# EAGLE schematic Brainstorm (EAGLE 9.0.1)
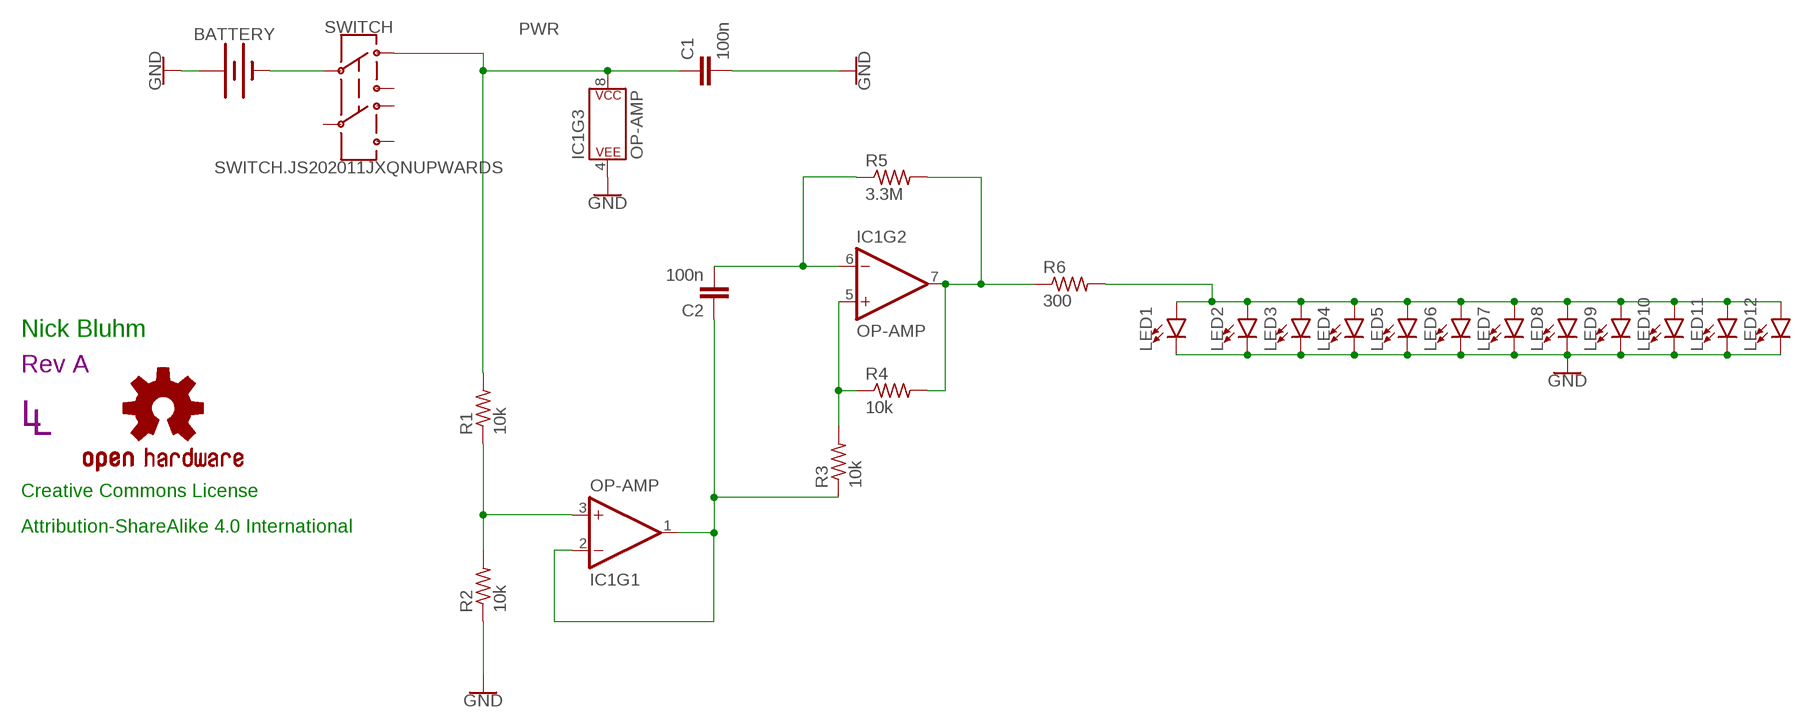
[diagram p0: schematic, sheet 1]

## Parts
BATTERY  BATTERY-20MM_SMD  [BATTCON_20MM]
C1  100n  CAPACITOR0402  [C0402]
C2  100n  CAPACITOR0402  [C0402]
IC1  OP-AMP  OPAMP-DUALU  [SO08]
LED1  LED5MM  [LED_5MM]
LED2  LED5MM  [LED_5MM]
LED3  LED5MM  [LED_5MM]
LED4  LED5MM  [LED_5MM]
LED5  LED5MM  [LED_5MM]
LED6  LED5MM  [LED_5MM]
LED7  LED5MM  [LED_5MM]
LED8  LED5MM  [LED_5MM]
LED9  LED5MM  [LED_5MM]
LED10  LED5MM  [LED_5MM]
LED11  LED5MM  [LED_5MM]
LED12  LED5MM  [LED_5MM]
LOGO1  OSHW-LOGOL-COPPER  [OSHW-LOGO-L_COPPER]
R1  10k  RESISTOR0603  [R0603]
R2  10k  RESISTOR0603  [R0603]
R3  10k  RESISTOR0603  [R0603]
R4  10k  RESISTOR0603  [R0603]
R5  3.3M  RESISTOR0603  [R0603]
R6  300  RESISTOR0603  [R0603]
SWITCH  SWITCH.JS202011JXQNUPWARDS  [SWITCH.00]
U$4  REVISION.A  [REV.A]
U$5  LINNES.LAB.LOGO  [LINNES.LAB.LOGO]

## Nets
GND: BATTERY.1(+) C1.2 IC1.4(P$V-) LED1.K(C) LED2.K(C) LED3.K(C) LED4.K(C) LED5.K(C) LED6.K(C) LED7.K(C) LED8.K(C) LED9.K(C) LED10.K(C) LED11.K(C) LED12.K(C) R2.1
N$2: IC1.3(+IN) R1.1 R2.2
N$3: LED1.A LED2.A LED3.A LED4.A LED5.A LED6.A LED7.A LED8.A LED9.A LED10.A LED11.A LED12.A R6.2
N$4: C2.1 IC1.1(OUT) IC1.2(-IN) R3.1
N$5: C2.2 IC1.6(-IN) R5.1
N$6: IC1.5(+IN) R3.2 R4.1
N$7: IC1.7(OUT) R4.2 R5.2 R6.1
N$9: BATTERY.2(-) SWITCH.2
PWR: C1.1 IC1.8(P$V+) R1.2 SWITCH.1
Unconnected: SWITCH.3 SWITCH.5 SWITCH.6 SWITCH.7

## Notes on the sheet
- Nick Bluhm
- Creative Commons License
- Attribution-ShareAlike 4.0 International

## Library data of the parts
BATTERY = SparkFun-Batteries:BATTERY: Battery - Single Cell A variety of battery chemistries, sizes, and footprints. Device List: 20MM_PTH - Coin Cell Battery Holder - 20mm (PTH) <https://www.sparkfun.com/products/783> 6.8MM_PTH - Coin Cell Battery Holder - 6.8MM(SMD) <https://www.digikey.com/product-detail/en/seiko-instruments/MS621FE-FL11E/728-1057-ND/1889208?WT.srch=1&gclid=CNOQ5a6LzdQCFZS2wAodXCkE0g> 12MM_SMD - Coin Cell Battery Holder - 12mm (SMD) <https://www.sparkfun.com/products/10592> 12MM_PTH - Coin Cell Battery Holder - 12mm (PTH) <https://www.sparkfun.com/products/7948> 20MM_SMD - 20mm Coin Cell Battery Holder (SMD) (2 legs) Used on the Big Time Watch Kit <https://www.sparkfun.com/products/11734> 20MM_SMD_4LEGS - Coin Cell Battery Holder - 20mm (SMD) <https://www.sparkfun.com/products/11892> 20MM_SMD_4LEGS_OVERPASTE - Coin Cell Battery Holder - 20mm (SMD) <https://www.sparkfun.com/products/11892> (Over-paste on the legs) 24.5MM_PTH - Coin Cell Battery Holder - 24.5mm (PTH) <https://www.sparkfun.com/products/8863> 9V - 9V Battery Holder - PC Mount Used on the SparkFun SparkPunk Sound Kit <https://www.sparkfun.com/products/11177> and SparkFun SparkPunk Sequencer Kit <https://www.sparkfun.com/products/12707> 18650 - Battery Holder - 18650 (PTH) <https://www.sparkfun.com/products/13113> AA - Battery Holder - 1xAA (PTH) <https://www.sparkfun.com/products/7949> AAA - Battery Holder - 1xAAA (PTH) <https://www.sparkfun.com/products/12718> AA_KIT - Battery Holder - 1xAA (PTH) <https://www.sparkfun.com/products/7949> Special kit package - pads only have exposed copper on one side of the board. AAA_KIT - Battery Holder - 1xAAA (PTH) <https://www.sparkfun.com/products/12718> Special kit package - pads only have exposed copper on one side of the board.; PROD_ID: BATT-11519
C1 C2 = CalvEngIO-Passives:CAPACITOR
IC1 = SparkFun-IC-Amplifiers:OPAMP-DUAL: Generic op-amp footprint This component is for the standard 358 pinning of a dual op-amp From the LM358 datasheet: Pin 1: Output A Pin 2: Inverting Input A Pin 3: Non-Inverting Input A Pin 4: Gnd Pin 5: Non-Inverting Input B Pin 6: Inverting Input B Pin 7: Output B Pin 8: V+; PROD_ID: NA-XXXXX
LED1-LED12 = CalvEngIO-LED:LED: LED (Generic) Standard schematic elements and footprints for 5mm, 3mm, 1206, and 0603 sized LEDs. Generic LEDs with no color specified. LTST-C190KGKT: arrow indicates cathode
LOGO1 = CalvEngIO-Logos:OSHW-LOGO: Open-Source Hardware (OSHW) Logo This logo indicates the piece of hardware it is found on incorporates a OSHW license and/or adheres to the definition of open source hardware found here: http://freedomdefined.org/OSHW
R1-R6 = CalvEngIO-Passives:RESISTOR
SWITCH = CalvEngIO-Switches:SWITCH.JS202011JXQN: Manufacturer's Part Numer: JS202011JAQN for right angle throw JS202011JCQN for top side throw
U$4 = CalvEngIO-Symbols:REVISION.A
U$5 = CalvEngIO-Logos:LINNES.LAB.LOGO